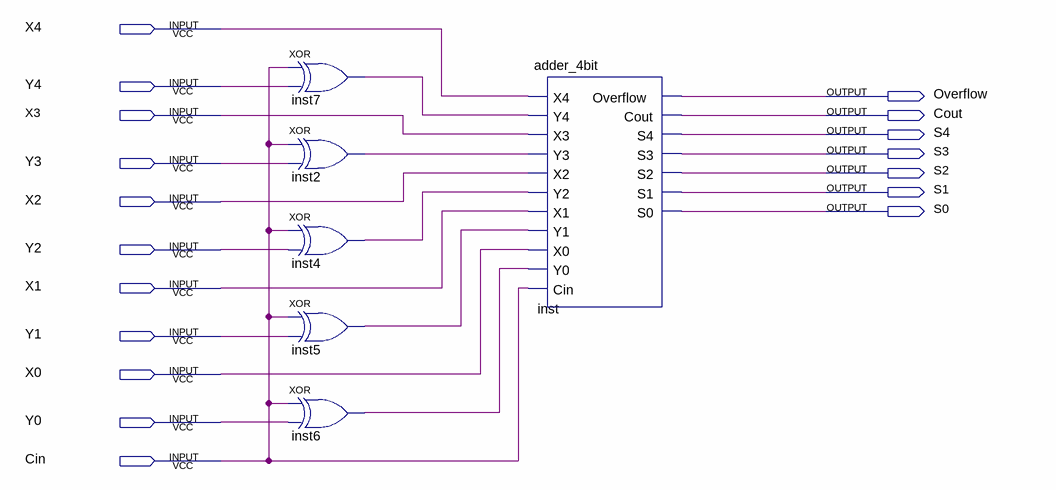
[diagram p0: schematic sheet]
// Quartus schematic add_sub.bdf as structural Verilog: 6 symbols, 18 pins
module add_sub (
  input  X4,
  input  Y4,
  input  X3,
  input  Y3,
  input  X2,
  input  Y2,
  input  X1,
  input  Y1,
  input  X0,
  input  Y0,
  input  Cin,
  output Overflow,
  output Cout,
  output S4,
  output S3,
  output S2,
  output S1,
  output S0
);

  wire inst2_out, inst4_out, inst5_out, inst6_out, inst7_out;

  xor inst7 (inst7_out, Cin, Y4);
  xor inst2 (inst2_out, Cin, Y3);
  xor inst4 (inst4_out, Cin, Y2);
  xor inst5 (inst5_out, Cin, Y1);
  xor inst6 (inst6_out, Cin, Y0);
  adder_4bit inst (
    .X4(X4), .Y4(inst7_out), .X3(X3), .Y3(inst2_out), .X2(X2), .Y2(inst4_out), .X1(X1), .Y1(inst5_out),
    .X0(X0), .Y0(inst6_out), .Cin(Cin), .Overflow(Overflow), .Cout(Cout), .S4(S4), .S3(S3), .S2(S2), .S1(S1),
    .S0(S0));
endmodule
